# Altium schematic sheet 6_P5_camera.schdoc
size 307 x 218 mm; Symbol: Sheet-Symbol_A4; Device: Sheet-Symbol_A4; @Project Name: modular_design; @Page Count: 6; @Update Date: 2026-07-06; @Create Date: 2026-07-06; @Schematic Name: Schematic1; @Page No: 6; @Page Name: P5_camera; @Board Name: Board1; Company: 嘉立创EDA; Version: V1.0; Page Size: A4; Convert to PCB: yes; Add into BOM: yes; Title Block Position: 3; Width: 1170; Height: 825; Region Start: 1; X Region Count: 6; Y Region Count: 4; Blade Width: 10; @Create Time: 06:23:16; @Update Time: 14:24:16
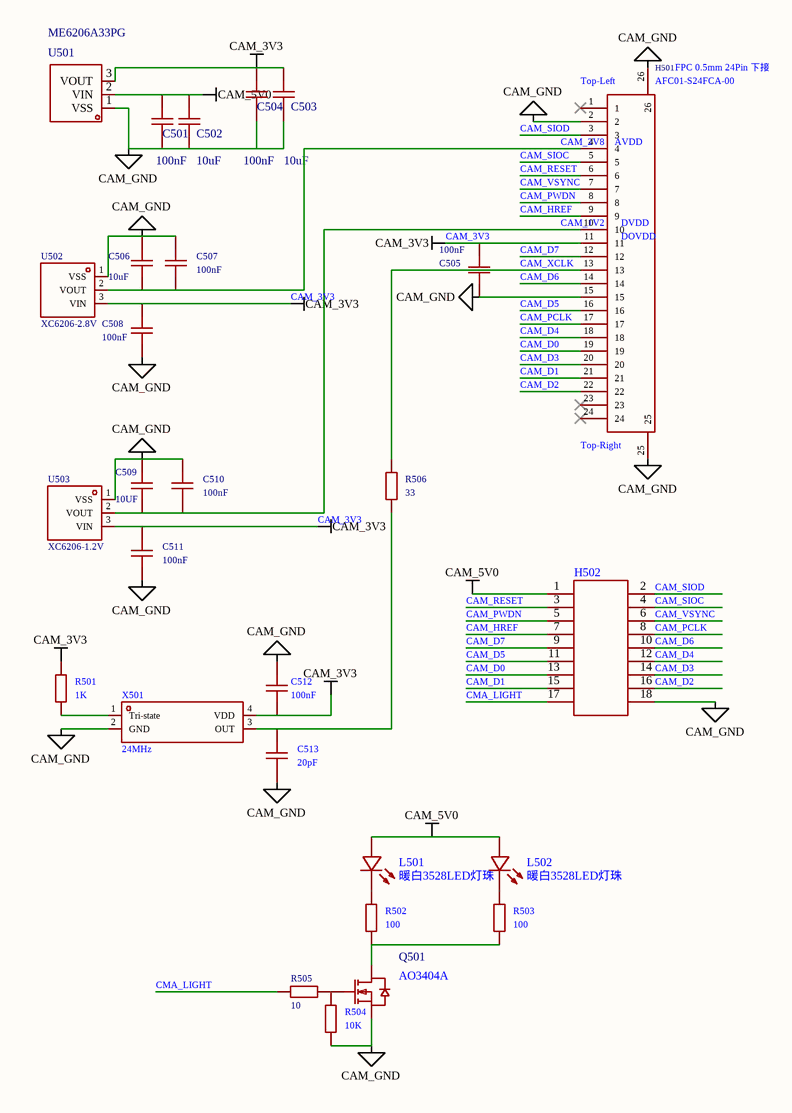
[diagram p0: 6_P5_camera.schdoc]

## Parts
C501  100nF  [C0603]
C502  10uF  [C0603]
C503  10uF  [C0603]
C504  100nF  [C0603]
C505  100nF  [C0603]
C506  10uF  [C0603]
C507  100nF  [C0603]
C508  100nF  [C0603]
C509  10UF  [C0603]
C510  100nF  [C0603]
C511  100nF  [C0603]
C512  100nF  [C0603]
C513  20pF  [C0603]
H501  AFC01-S24FCA-00  [FPC-SMD_P0.50-24P_FGS-XJ-H2.0]
H502  (no value)  [Finger_2*9]
L501  暖白3528LED灯珠  [LED-SMD_L3.6-W2.9-R-RD]
L502  暖白3528LED灯珠  [LED-SMD_L3.6-W2.9-R-RD]
Q501  AO3404A  [SOT-23_L2.9-W1.3-P1.90-LS2.4-BR]
R501  1K  [R0603]
R502  100  [R0603]
R503  100  [R0603]
R504  10K  [R0603]
R505  10  [R0603]
R506  33  [R0603]
U501  ME6206A33PG  [SOT-89-3_L4.5-W2.5-P1.50-LS4.2-BR]
U502  XC6206-2.8V  [SOT-23-3_L2.9-W1.6-P1.90-LS2.8-BR]
U503  XC6206-1.2V  [SOT-23-3_L2.9-W1.6-P1.90-LS2.8-BR]
X501  24MHz  [OSC-SMD_4P-L3.2-W2.5-BL]

## Nets
CAM_3V3: C503.2 C504.2 C505.2 C508.2 C511.2 C512.1 H501.11 R501.2 U501.3(VOUT) U502.3(VIN) U503.3(VIN) X501.4(VDD)
CAM_5V0: C501.2 C502.2 H502.1 L501.1(A) L502.1(A) U501.2(VIN)
CAM_GND: C501.1 C502.1 C503.1 C504.1 C505.1 C506.2 C507.2 C508.1 C509.2 C510.2 C511.1 C512.2 C513.1 H501.2 H501.15 H501.25 H501.26 H502.18 Q501.2(S) R504.1 U501.1(VSS) U502.1(VSS) U503.1(VSS) X501.2(GND)
CAM_1V2: C509.1 C510.1 H501.10 U503.2(VOUT)
CAM_2V8: C506.1 C507.1 H501.4 U502.2(VOUT)
CAM_D0: H501.19 H502.13
CAM_D1: H501.21 H502.15
CAM_D2: H501.22 H502.16
CAM_D3: H501.20 H502.14
CAM_D4: H501.18 H502.12
CAM_D5: H501.16 H502.11
CAM_D6: H501.14 H502.10
CAM_D7: H501.12 H502.9
CAM_HREF: H501.9 H502.7
CAM_PCLK: H501.17 H502.8
CAM_PWDN: H501.8 H502.5
CAM_RESET: H501.6 H502.3
CAM_SIOC: H501.5 H502.4
CAM_SIOD: H501.3 H502.2
CAM_VSYNC: H501.7 H502.6
CAM_XCLK: H501.13 R506.1
CMA_LIGHT: H502.17 R505.2
NetC513_2: C513.2 R506.2 X501.3(OUT)
NetL501_2: L501.2(K) R502.2
NetL502_2: L502.2(K) R503.2
NetQ501_1: Q501.1(G) R504.2 R505.1
NetQ501_3: Q501.3(D) R502.1 R503.1
NetR501_1: R501.1 X501.1(Tri-state)

Not connected (* = marked no-connect by the designer): H501 1* 23* 24*

## Notes on the sheet
- (near H501) Top-Left
- (near H501) FPC 0.5mm 24Pin 下接
- (near H501) AVDD
- (near H501) DVDD
- (near H501) DOVDD
- (near H501) Top-Right
- 1
- 2
- 3
- 4
- 5
- 6
- A
- B
- C
- 原理图
- Schematic1
- 创建日期
- 更新日期
- 2026-07-06
- 绘制
- 板子
- Board1
- 图页
- P5_camera
- D
- 审阅
- 版本
- 尺寸
- modular_design
- 页
- 共
- V1.0
- A4
- 嘉立创EDA

## Library data of the parts
C501-C504 = CAP_0603: Convert to PCB: yes; Symbol: CAP_0603; Device: CAP_0603; Add into BOM: yes; Supplier Footprint: 0603; Origin Footprint: C0603
  C501 C504: Value: 100nF
  C502 C503: Value: 10uF
C505 C507 C508 C510 C511 = CAP_0603: Symbol: CapAcitance; Convert to PCB: yes; Value: 0.1UF; Device: CAP_0603; Add into BOM: yes; Supplier Footprint: 0603
C506 C509 C512 C513 = CAP_0603: Symbol: CapAcitance; Convert to PCB: yes; Device: CAP_0603; Add into BOM: yes; Supplier Footprint: 0603
  C506 C509: Value: 10UF
  C512: Value: 100nF
  C513: Value: 20pF
H501 = AFC01-S24FCA-00: Manufacturer: JS(钜硕电子); Add into BOM: yes; Pitch: 0.5mm; Number of Contacts: 24P; Locking Feature: 翻盖式; FFC, FCB Thickness: 0.3mm; Symbol: AFC01-S24FCA-00; Device: AFC01-S24FCA-00; Supplier: LCSC; Supplier Part: C262669; Manufacturer Part: AFC01-S24FCA-00; JLCPCB Part Class: 扩展库; LCSC Part Name: 0.5mm P数:24P 翻盖式 下接; Supplier Footprint: SMD,P=0.5mm; Datasheet: https://atta.szlcsc.com/upload/public/pdf/source/20190816/C413942_2A72D1AC756EAE17EEDF756A339D4500.pdf; Convert to PCB: yes; Mounting Type: 卧贴; Contact Type: 下接; Height Above Board: 2mm
H502 = conn-2*9p: Add into BOM: yes; Symbol: conn-2*9p; Device: conn-2*9p; Convert to PCB: yes
L501 L502 = 暖白3528LED灯珠: Symbol: KT-3528W; Add into BOM: yes; Device: 暖白3528LED灯珠; LCSC Part Name: 暖白 3528 LED灯珠; Supplier Part: C26545; Manufacturer Part: 暖白3528LED灯珠; Supplier Footprint: 3528; JLCPCB Part Class: Extended Part; Supplier: LCSC; Convert to PCB: yes
Q501 = AO3404A: Manufacturer: AOS; Add into BOM: yes; Type: N沟道; Drain Source Voltage (Vdss): 30V; Continuous Drain Current (Id): 5.8A; Power Dissipation (Pd): 1.4W; Drain Source On Resistance (RDS(on)@Vgs,Id): 28mΩ@10V,5.8A; Gate Threshold Voltage (Vgs(th)@Id): 3V@250μA; Symbol: AO3404A; Device: AO3404A; LCSC Part Name: N沟道 30V 5.8A; Supplier Part: C30010; Manufacturer Part: AO3404A; Supplier Footprint: SOT-23-3L; JLCPCB Part Class: Extended Part; Datasheet: https://atta.szlcsc.com/upload/public/pdf/source/20191220/C30010_DF67985E36B4CD05195D0D938BA71633.pdf; Supplier: LCSC; Convert to PCB: yes
R501 = Res_0603: Symbol: 电阻; Convert to PCB: yes; Device: Res_0603; Add into BOM: yes; Supplier Footprint: 0603; Value: 1K
R502-R506 = Res_0603: Symbol: 电阻; Convert to PCB: yes; Value: 1K; Device: Res_0603; Add into BOM: yes; Supplier Footprint: 0603
U501 = ME6209A33PG: Manufacturer: MICRONE(南京微盟); Add into BOM: yes; Output Type: 固定; Output Polarity: 正; Number of Outputs: 1; Maximum Input Voltage: 18V; Output Voltage: 3.3V; Dropout Voltage: 80mV@(40mA); Output Current: 250mA; Symbol: ME6209A33PG; Device: ME6209A33PG; LCSC Part Name: Vin=18V Vout=3.3V 250mA; Supplier Part: C80222; Manufacturer Part: ME6209A33PG; Supplier Footprint: SOT-89(SOT-89-3); JLCPCB Part Class: Extended Part; Datasheet: https://atta.szlcsc.com/upload/public/pdf/source/20160903/1472896599532.pdf; Supplier: LCSC; Convert to PCB: yes; Power Supply Rejection Ratio (PRSS): -; Origin Footprint: SOT-89-3_L4.5-W2.5-P1.50-LS4.2-BR
U502 U503 = XC6206-2.8V: Manufacturer: YONGYUTAI(永裕泰); Add into BOM: yes; Output Type: 固定; Output Polarity: 正; Number of Outputs: 1; Maximum Input Voltage: 6V; Output Voltage: 2.8V; Output Current: 250mA; Symbol: XC6206-2.8V; Device: XC6206-2.8V; LCSC Part Name: XC6206-2.8V; Supplier Part: C2892669; Supplier Footprint: SOT-23-3L; JLCPCB Part Class: 扩展库; Datasheet: https://atta.szlcsc.com/upload/public/pdf/source/20210901/DE3C77F0CE73FFE8F7C655BE9B94CB06.pdf; Supplier: LCSC; Convert to PCB: yes; Operating Temperature: -40℃~+85℃@(Tj)
  U502: Manufacturer Part: XC6206-2.8V
  U503: Manufacturer Part: XC6206-1.2V
X501 = OT2EL4C4JI-111OLP-24M: Manufacturer: YXC(扬兴晶振); Add into BOM: yes; Normal temperature Frequency Tolerance: ±10ppm; Output Type: CMOS; Supply Voltage: 1.8V~3.3V; Symbol: OT2EL4C4JI-111OLP-24M; Device: OT2EL4C4JI-111OLP-24M; Supplier: LCSC; Supplier Part: C5203548; Manufacturer Part: OT2EL4C4JI-111OLP-24M; Value: 24MHz; JLCPCB Part Class: 扩展库; LCSC Part Name: 24MHZ 1.8V-3.3V ±10PPM YSO110TR; Supplier Footprint: SMD3225-4P; Datasheet: https://atta.szlcsc.com/upload/public/pdf/source/20231227/5563D7688935AB8F439681C72F60F823.pdf; Convert to PCB: yes; Operating Temperature: -40℃~+85℃